# EAGLE schematic rtc module (EAGLE 6.5.0)
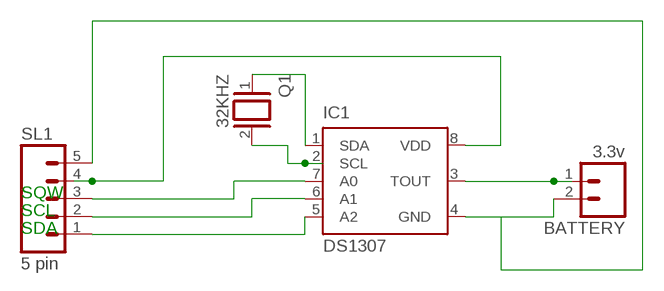
[diagram p0: schematic, sheet 1]

## Parts
BATTERY  3.3v  M02  [02P]
IC1  DS1307  DS1621  [DIL08]
Q1  32KHZ  XTAL/S  [QS]
SL1  5 pin  M05  [05P]

## Nets
N$1: IC1.1(SDA) Q1.1
N$2: IC1.2(SCL) Q1.2
N$3: IC1.6(A1) SL1.2
N$4: IC1.7(A0) SL1.3
N$5: IC1.8(VDD) SL1.4
N$6: BATTERY.1 IC1.3(TOUT)
N$7: BATTERY.2 IC1.4(GND) SL1.5
N$8: IC1.5(A2) SL1.1

## Notes on the sheet
- SQW
- SCL
- SDA

## Library data of the parts
BATTERY = con-amp-quick:M02: AMP QUICK CONNECTOR; OC_FARNELL: unknown; OC_NEWARK: unknown
IC1 = maxim:DS1621: Digital Thermometer and Thermostat Source: http://pdfserv.maxim-ic.com/en/ds/DS1621.pdf; MPN: DS1621; OC_FARNELL: 1188024; OC_NEWARK: 66F3769
Q1 = special:XTAL/S: CRYSTAL
SL1 = con-amp-quick:M05: AMP QUICK CONNECTOR; OC_FARNELL: unknown; OC_NEWARK: unknown